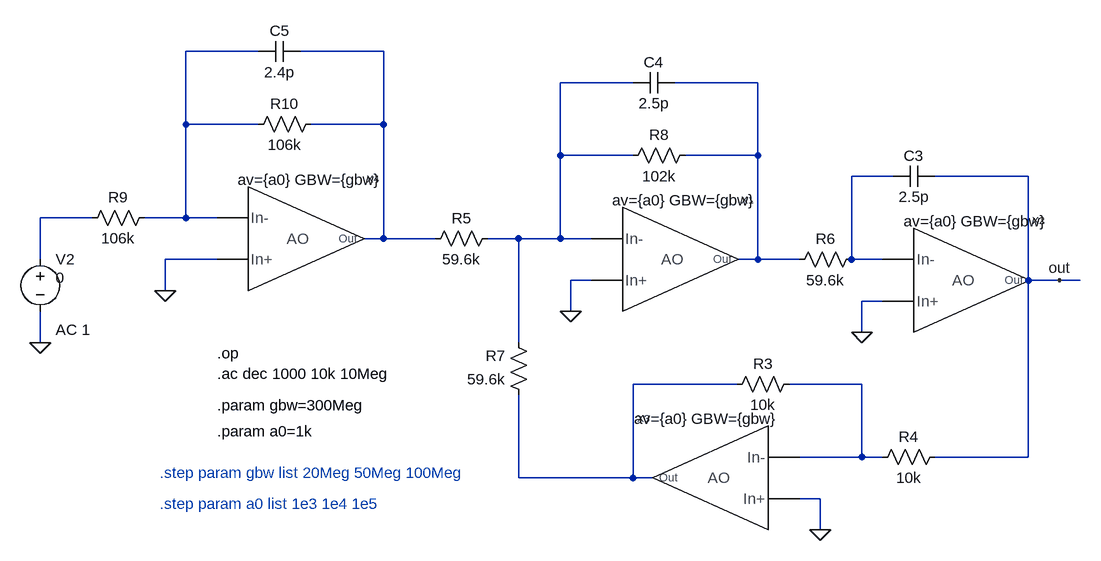
[diagram p0: schematic FTJ_ord3_TowThomas_AO_2poles.asc]
FTJ_ord3_TowThomas_AO_2poles.asc, the LTspice schematic file:
Version 4
SHEET 1 2712 1708
WIRE 1440 -144 1328 -144
WIRE 1632 -144 1504 -144
WIRE 2016 -96 1904 -96
WIRE 2208 -96 2080 -96
WIRE 1328 -32 1328 -144
WIRE 1440 -32 1328 -32
WIRE 1632 -32 1632 -144
WIRE 1632 -32 1520 -32
WIRE 1904 16 1904 -96
WIRE 2016 16 1904 16
WIRE 2208 16 2208 -96
WIRE 2208 16 2096 16
WIRE 2416 48 2352 48
WIRE 2624 48 2480 48
WIRE 1184 112 1104 112
WIRE 1328 112 1328 -32
WIRE 1328 112 1264 112
WIRE 1376 112 1328 112
WIRE 1632 144 1632 -32
WIRE 1632 144 1600 144
WIRE 1712 144 1632 144
WIRE 1840 144 1792 144
WIRE 1904 144 1904 16
WIRE 1904 144 1840 144
WIRE 1952 144 1904 144
WIRE 1104 176 1104 112
WIRE 1376 176 1296 176
WIRE 2208 176 2208 16
WIRE 2208 176 2176 176
WIRE 2272 176 2208 176
WIRE 2352 176 2352 48
WIRE 2400 176 2352 176
WIRE 1952 208 1920 208
WIRE 2624 208 2624 48
WIRE 2672 208 2624 208
WIRE 2704 208 2672 208
WIRE 1296 224 1296 176
WIRE 2400 240 2368 240
WIRE 1920 256 1920 208
WIRE 2368 288 2368 240
WIRE 1104 304 1104 256
WIRE 1840 304 1840 144
WIRE 2176 368 2016 368
WIRE 2368 368 2256 368
WIRE 2368 480 2368 368
WIRE 2368 480 2272 480
WIRE 2400 480 2368 480
WIRE 2624 480 2624 208
WIRE 2624 480 2480 480
WIRE 1840 512 1840 384
WIRE 2016 512 2016 368
WIRE 2016 512 1840 512
WIRE 2048 512 2016 512
WIRE 2304 544 2272 544
WIRE 2304 592 2304 544
FLAG 1104 304 0
FLAG 2672 208 out
FLAG 1296 224 0
FLAG 1920 256 0
FLAG 2368 288 0
FLAG 2304 592 0
DATAFLAG 1136 112 ""
DATAFLAG 1632 -96 ""
DATAFLAG 1872 144 ""
DATAFLAG 2624 320 ""
SYMBOL cap 2480 32 R90
WINDOW 0 0 32 VBottom 2
WINDOW 3 32 32 VTop 2
SYMATTR InstName C3
SYMATTR Value 2.5p
SYMBOL res 2272 352 R90
WINDOW 0 0 56 VBottom 2
WINDOW 3 32 56 VTop 2
SYMATTR InstName R3
SYMATTR Value 10k
SYMBOL res 2496 464 R90
WINDOW 0 0 56 VBottom 2
WINDOW 3 32 56 VTop 2
SYMATTR InstName R4
SYMATTR Value 10k
SYMBOL cap 2080 -112 R90
WINDOW 0 0 32 VBottom 2
WINDOW 3 32 32 VTop 2
SYMATTR InstName C4
SYMATTR Value 2.5p
SYMBOL voltage 1104 160 R0
WINDOW 123 24 124 Left 2
WINDOW 39 0 0 Left 2
WINDOW 3 24 44 Left 2
SYMATTR Value2 AC 1
SYMATTR Value 0
SYMATTR InstName V2
SYMBOL res 1808 128 R90
WINDOW 0 0 56 VBottom 2
WINDOW 3 32 56 VTop 2
SYMATTR InstName R5
SYMATTR Value 59.6k
SYMBOL res 2368 160 R90
WINDOW 0 0 56 VBottom 2
WINDOW 3 32 56 VTop 2
SYMATTR InstName R6
SYMATTR Value 59.6k
SYMBOL res 1856 400 R180
WINDOW 0 36 76 Left 2
WINDOW 3 36 40 Left 2
SYMATTR InstName R7
SYMATTR Value 59.6k
SYMBOL res 2112 0 R90
WINDOW 0 0 56 VBottom 2
WINDOW 3 32 56 VTop 2
SYMATTR InstName R8
SYMATTR Value 102k
SYMBOL res 1280 96 R90
WINDOW 0 0 56 VBottom 2
WINDOW 3 32 56 VTop 2
SYMATTR InstName R9
SYMATTR Value 106k
SYMBOL cap 1504 -160 R90
WINDOW 0 0 32 VBottom 2
WINDOW 3 32 32 VTop 2
SYMATTR InstName C5
SYMATTR Value 2.4p
SYMBOL res 1536 -48 R90
WINDOW 0 0 56 VBottom 2
WINDOW 3 32 56 VTop 2
SYMATTR InstName R10
SYMATTR Value 106k
SYMBOL AO_2poles 1424 144 R0
WINDOW 39 -16 -91 Left 2
SYMATTR SpiceLine av={a0} GBW={gbw}
SYMATTR InstName X4
SYMBOL AO_2poles 2000 176 R0
WINDOW 39 -16 -91 Left 2
SYMATTR SpiceLine av={a0} GBW={gbw}
SYMATTR InstName X1
SYMBOL AO_2poles 2448 208 R0
WINDOW 39 -16 -91 Left 2
SYMATTR SpiceLine av={a0} GBW={gbw}
SYMATTR InstName X2
SYMBOL AO_2poles 2224 512 M0
WINDOW 39 -16 -91 Left 2
SYMATTR SpiceLine av={a0} GBW={gbw}
SYMATTR InstName X3
TEXT 1376 352 Left 2 !.ac dec 1000 10k 10Meg
TEXT 1376 400 Left 2 !.param gbw=300Meg
TEXT 1376 320 Left 2 !.op
TEXT 1376 440 Left 2 !.param a0=1k
TEXT 1288 504 Left 2 ;.step param gbw list 20Meg 50Meg 100Meg
TEXT 1288 552 Left 2 ;.step param a0 list 1e3 1e4 1e5

The netlist it stands for:
* FTJ_ord3_TowThomas_AO_2poles.asc
C3 out N005 2.5p
R3 N008 N007 10k
R4 out N008 10k
C4 N004 N003 2.5p
V2 N006 0 0 AC 1
R5 N003 N002 59.6k
R6 N005 N004 59.6k
R7 N007 N003 59.6k
R8 N004 N003 102k
R9 N001 N006 106k
C5 N002 N001 2.4p
R10 N002 N001 106k
XX4 N001 N002 0 AO_2poles params: av={a0} GBW={gbw}  ; pins In- Out In+
XX1 N003 N004 0 AO_2poles params: av={a0} GBW={gbw}  ; pins In- Out In+
XX2 N005 out 0 AO_2poles params: av={a0} GBW={gbw}  ; pins In- Out In+
XX3 N008 N007 0 AO_2poles params: av={a0} GBW={gbw}  ; pins In- Out In+
.ac dec 1000 10k 10Meg
.param gbw=300Meg
.op
.param a0=1k
* .step param gbw list 20Meg 50Meg 100Meg
* .step param a0 list 1e3 1e4 1e5
.backanno
.end